# EAGLE schematic LumiBeePCB_v1A_2130spi_1 (EAGLE 9.4.1)
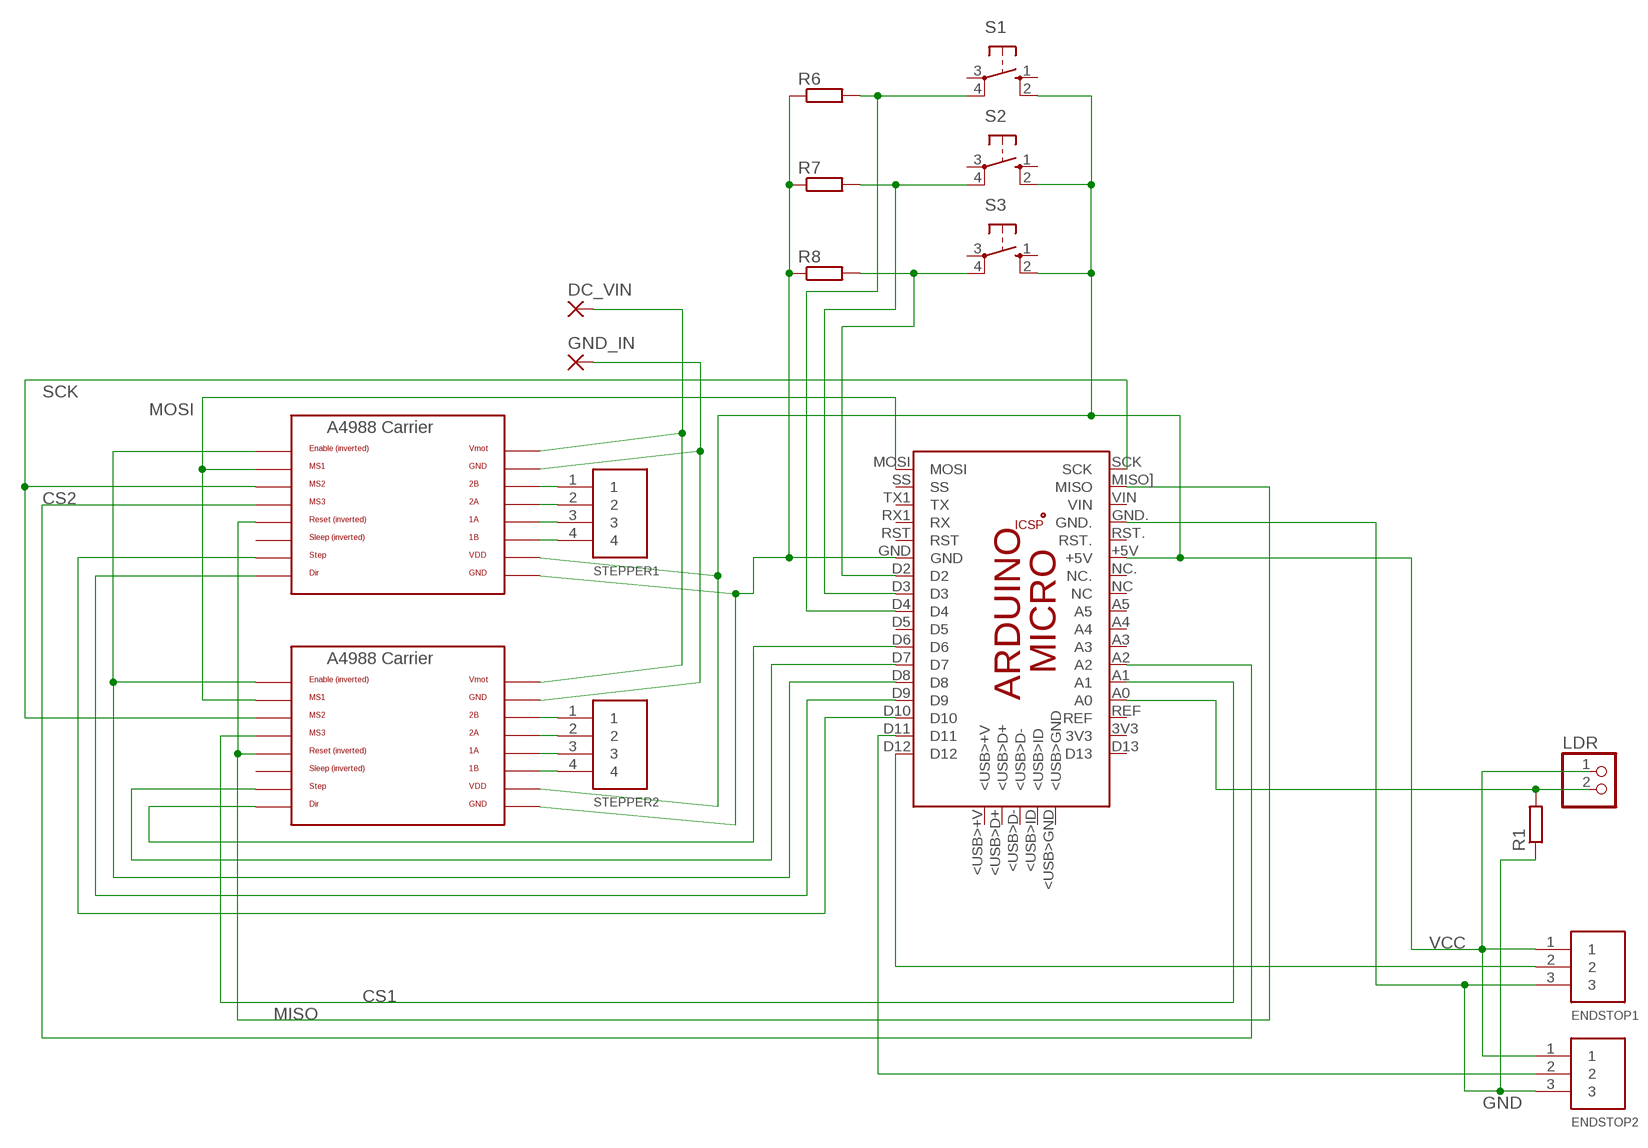
[diagram p0: schematic, sheet 1]

## Parts
DC_VIN  2,54/0,8  [2,54/0,8]
ENDSTOP1  3PIN  [B3B-PH-K-S]
ENDSTOP2  3PIN  [B3B-PH-K-S]
GND_IN  2,54/0,8  [2,54/0,8]
LDR  PINHD-1X2  [1X02]
PCB1  ARDUINO_MICRO  [ARDUINO_MICRO]
R1  R-EU_M1206  [M1206]
R6  R-EU_M1206  [M1206]
R7  R-EU_M1206  [M1206]
R8  R-EU_M1206  [M1206]
S1  10-XX  [B3F-10XX]
S2  10-XX  [B3F-10XX]
S3  10-XX  [B3F-10XX]
STEPPER1  4PIN  [B4B-PH-K-S]
STEPPER2  4PIN  [B4B-PH-K-S]
U$1  A4988BREAKOUT  [A4988BREAKOUT]
U$2  A4988BREAKOUT  [A4988BREAKOUT]

## Nets
CS1: PCB1.A1 U$2.MS3
CS2: PCB1.A2 U$1.MS3
GND: ENDSTOP1.3 ENDSTOP2.3 PCB1.GND. R1.1
MISO: PCB1.MISO](MISO) U$1.RST U$2.RST
MOSI: PCB1.MOSI U$1.MS1 U$2.MS1
N$8 [power]: GND_IN.1(P) U$1.GND U$2.GND
N$9 [power]: DC_VIN.1(P) U$1.VMOT U$2.VMOT
N$10 [power]: STEPPER1.1 U$1.2B
N$11: PCB1.GND R6.1 R7.1 R8.1 U$1.GND@0(GND) U$2.GND@0(GND)
N$12: ENDSTOP1.2 PCB1.D12
N$13 [power]: STEPPER1.2 U$1.2A
N$14 [power]: STEPPER1.3 U$1.1A
N$15 [power]: STEPPER1.4 U$1.1B
N$16 [power]: STEPPER2.1 U$2.2B
N$17 [power]: STEPPER2.2 U$2.2A
N$18 [power]: STEPPER2.3 U$2.1A
N$19 [power]: STEPPER2.4 U$2.1B
N$20: ENDSTOP2.2 PCB1.D11
N$21: PCB1.D10 U$1.STEP
N$22: PCB1.D9 U$1.DIR
N$23: PCB1.D8 U$1.EN U$2.EN
N$24: PCB1.D7 U$2.STEP
N$25: PCB1.D6 U$2.DIR
N$29: LDR.2 PCB1.A0 R1.2
N$31: PCB1.D2 R8.2 S3.4(P1)
N$41: PCB1.D3 R7.2 S2.4(P1)
N$42: PCB1.D4 R6.2 S1.4(P1)
SCK: PCB1.SCK U$1.MS2 U$2.MS2
VCC: ENDSTOP1.1 ENDSTOP2.1 LDR.1 PCB1.+5V S1.2(S1) S2.2(S1) S3.2(S1) U$1.VDD U$2.VDD
Unconnected: PCB1.3V3 PCB1.5V PCB1.<USB>+V PCB1.<USB>D+ PCB1.<USB>D- PCB1.<USB>GND PCB1.<USB>ID PCB1.A3 PCB1.A4 PCB1.A5 PCB1.D5 PCB1.D13 PCB1.GND_ PCB1.MISO. PCB1.MOSI. PCB1.NC PCB1.NC. PCB1.REF PCB1.RESET.. PCB1.RST PCB1.RST. PCB1.RX1(RX) PCB1.SCK. PCB1.SS PCB1.TX1(TX) PCB1.VIN S1.1(S) S1.3(P) S2.1(S) S2.3(P) S3.1(S) S3.3(P) U$1.SLP(SLEEP) U$2.SLP(SLEEP)

## Library data of the parts
DC_VIN GND_IN = wirepad:2,54/0,8: THROUGH-HOLE PAD
ENDSTOP1 ENDSTOP2 = jst_eph:3PIN
LDR = pinhead:PINHD-1X2: PIN HEADER
PCB1 = E14_Arduino_revC:ARDUINO_MICRO: Device for representing an Arduino Micro board with a footprint in an EAGLE design. Created by Dave Young for Element14. More EAGLE documentation at: http://www.element14.com/community/community/knode/cadsoft_eagle
R1 R6-R8 = rcl:R-EU_: RESISTOR, European symbol; SPICEPREFIX: R
S1-S3 = switch-omron:10-XX: OMRON SWITCH; MPN: B3F-1000; OC_FARNELL: 176432; OC_NEWARK: 36M3542
STEPPER1 STEPPER2 = jst_eph:4PIN
U$1 U$2 = RepRapjr:A4988BREAKOUT

## Net classes
1 power: width 0.61 mm